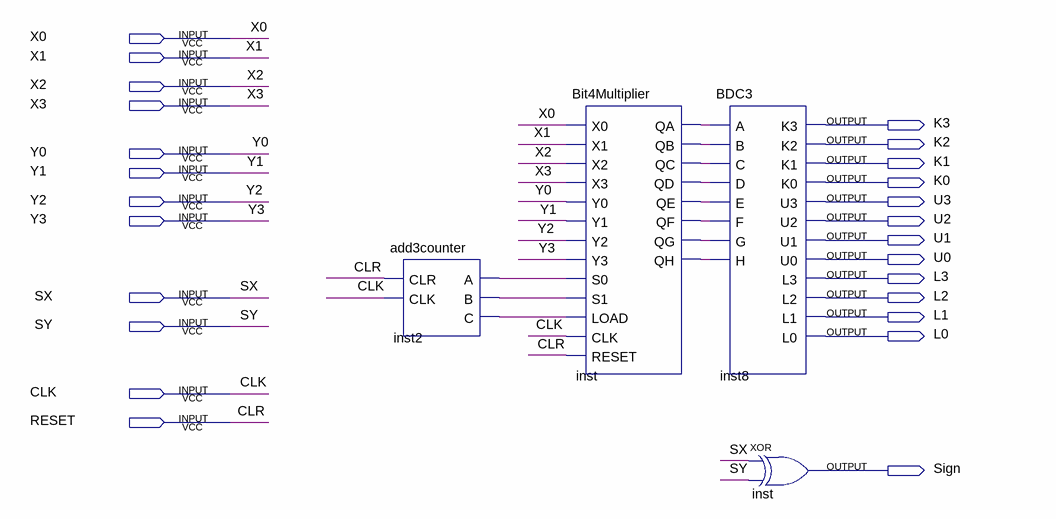
[diagram p0: schematic sheet]
// Quartus schematic MultCalc.bdf as structural Verilog: 4 symbols, 25 pins
module MultCalc (
  input  X0,
  input  X1,
  input  X2,
  input  X3,
  input  Y0,
  input  Y1,
  input  Y2,
  input  Y3,
  input  SX,
  input  SY,
  input  CLK,
  input  RESET,
  output K3,
  output K2,
  output K1,
  output K0,
  output U3,
  output U2,
  output U1,
  output U0,
  output L3,
  output L2,
  output L1,
  output L0,
  output Sign
);

  wire inst2_a, inst2_b, inst2_c, inst_qa, inst_qb, inst_qc, inst_qd, inst_qe, inst_qf, inst_qg, inst_qh;

  add3counter inst2 (.CLR(RESET), .CLK(CLK), .A(inst2_a), .B(inst2_b), .C(inst2_c));
  Bit4Multiplier inst (
    .X0(X0), .X1(X1), .X2(X2), .X3(X3), .Y0(Y0), .Y1(Y1), .Y2(Y2), .Y3(Y3), .S0(inst2_a), .S1(inst2_b),
    .LOAD(inst2_c), .CLK(CLK), .RESET(RESET), .QA(inst_qa), .QB(inst_qb), .QC(inst_qc), .QD(inst_qd),
    .QE(inst_qe), .QF(inst_qf), .QG(inst_qg), .QH(inst_qh));
  BDC3 inst8 (
    .A(inst_qa), .B(inst_qb), .C(inst_qc), .D(inst_qd), .E(inst_qe), .F(inst_qf), .G(inst_qg), .H(inst_qh),
    .K3(K3), .K2(K2), .K1(K1), .K0(K0), .U3(U3), .U2(U2), .U1(U1), .U0(U0), .L3(L3), .L2(L2), .L1(L1), .L0(L0));
  xor inst_dup2 (Sign, SX, SY);

  // Other names for the same wires on the sheet: CLR = RESET
endmodule
